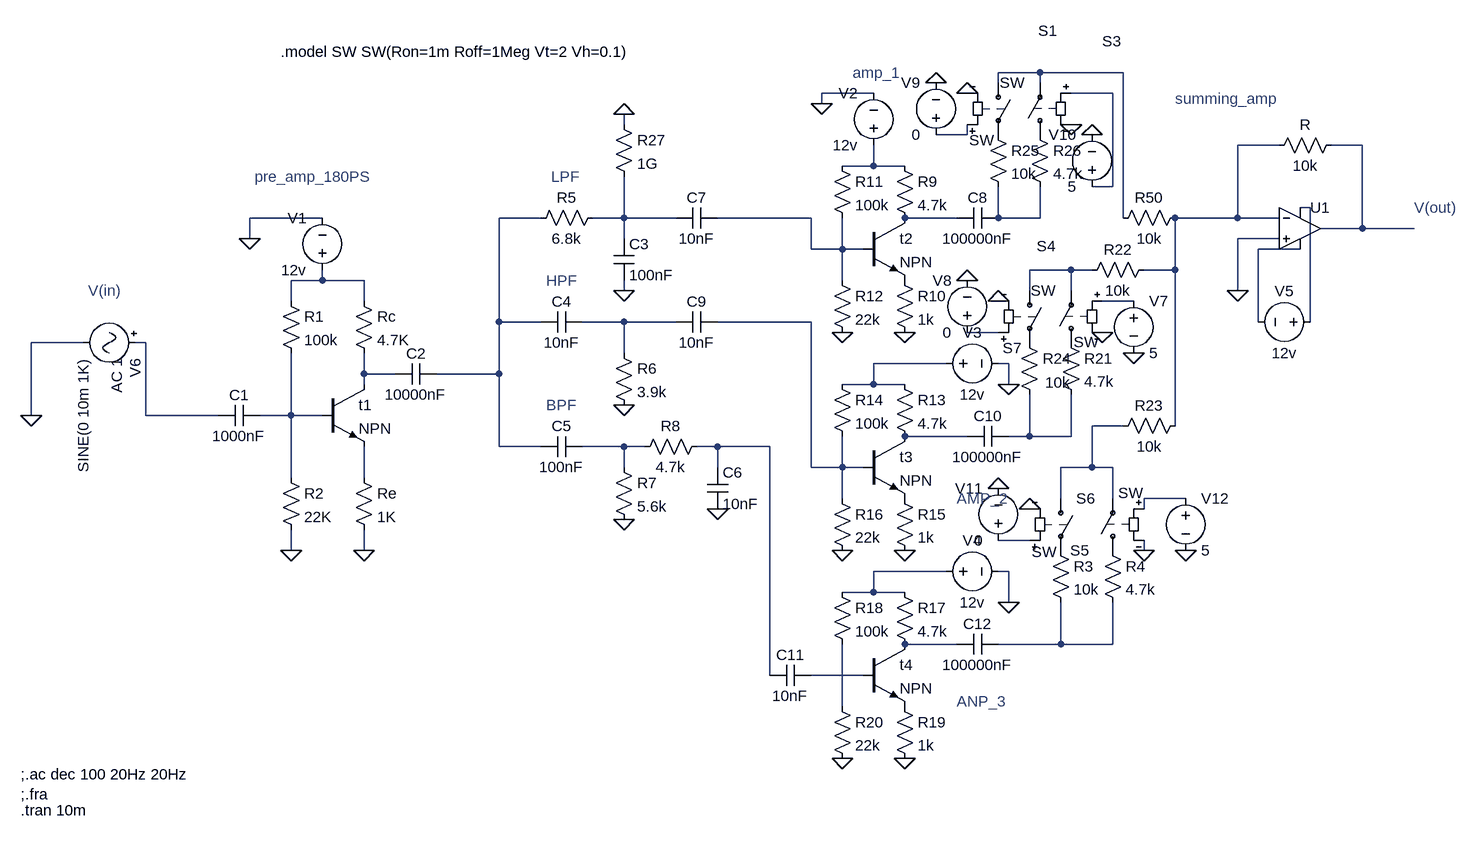
[diagram p0: schematic Audio_AMP.asc]
Audio_AMP.asc, the LTspice schematic file:
Version 4.1
SHEET 1 2056 688
WIRE 1120 -464 1056 -464
WIRE 1248 -464 1120 -464
WIRE 1056 -448 1056 -464
WIRE 1120 -448 1120 -464
WIRE 864 -432 784 -432
WIRE 1232 -432 1168 -432
WIRE 784 -416 784 -432
WIRE 480 -384 480 -400
WIRE 1008 -368 1008 -384
WIRE 1008 -368 960 -368
WIRE 1488 -352 1424 -352
WIRE 1616 -352 1568 -352
WIRE 864 -320 864 -352
WIRE 864 -320 816 -320
WIRE 912 -320 864 -320
WIRE 1232 -288 1232 -432
WIRE 1232 -288 1200 -288
WIRE 1536 -256 1520 -256
WIRE 16 -240 -96 -240
WIRE 352 -240 288 -240
WIRE 480 -240 480 -304
WIRE 480 -240 432 -240
WIRE 560 -240 480 -240
WIRE 768 -240 624 -240
WIRE 992 -240 912 -240
WIRE 1056 -240 1056 -288
WIRE 1120 -240 1120 -288
WIRE 1120 -240 1056 -240
WIRE 1248 -240 1248 -464
WIRE 1424 -240 1424 -352
WIRE 1424 -240 1328 -240
WIRE 1488 -240 1424 -240
WIRE 1616 -224 1616 -352
WIRE 1616 -224 1552 -224
WIRE 1696 -224 1616 -224
WIRE -96 -208 -96 -240
WIRE 480 -208 480 -240
WIRE 1488 -208 1424 -208
WIRE 768 -192 768 -240
WIRE 816 -192 816 -240
WIRE 816 -192 768 -192
WIRE 848 -192 816 -192
WIRE 1520 -192 1456 -192
WIRE 1168 -160 1104 -160
WIRE 1200 -160 1168 -160
WIRE 1328 -160 1328 -240
WIRE 1328 -160 1280 -160
WIRE 16 -144 16 -160
WIRE 16 -144 -32 -144
WIRE 80 -144 16 -144
WIRE 816 -144 816 -192
WIRE 480 -128 480 -144
WIRE 1104 -128 1104 -160
WIRE 1168 -128 1168 -160
WIRE 1424 -128 1424 -208
WIRE -32 -112 -32 -144
WIRE 80 -112 80 -144
WIRE 1264 -112 1216 -112
WIRE 288 -80 288 -240
WIRE 352 -80 288 -80
WIRE 480 -80 416 -80
WIRE 560 -80 480 -80
WIRE 768 -80 624 -80
WIRE 1456 -80 1456 -192
WIRE 1536 -80 1536 -256
WIRE 1056 -64 1008 -64
WIRE -352 -48 -432 -48
WIRE -256 -48 -272 -48
WIRE 480 -32 480 -80
WIRE 976 -16 864 -16
WIRE 1072 -16 1056 -16
WIRE 80 0 80 -32
WIRE 128 0 80 0
WIRE 288 0 288 -80
WIRE 288 0 192 0
WIRE 80 16 80 0
WIRE 864 16 864 -16
WIRE 864 16 816 16
WIRE 912 16 864 16
WIRE 1072 16 1072 -16
WIRE -432 64 -432 -48
WIRE -256 64 -256 -48
WIRE -144 64 -256 64
WIRE -32 64 -32 -32
WIRE -32 64 -80 64
WIRE 16 64 -32 64
WIRE 1248 80 1200 80
WIRE 1328 80 1328 -160
WIRE 1008 96 912 96
WIRE 1104 96 1104 32
WIRE 1104 96 1072 96
WIRE 1168 96 1168 32
WIRE 1168 96 1104 96
WIRE 288 112 288 0
WIRE 352 112 288 112
WIRE 480 112 416 112
WIRE 512 112 480 112
WIRE 624 112 592 112
WIRE 704 112 624 112
WIRE 480 144 480 112
WIRE 624 144 624 112
WIRE 768 144 768 -80
WIRE 816 144 816 96
WIRE 816 144 768 144
WIRE 848 144 816 144
WIRE 1200 144 1200 80
WIRE 1200 144 1152 144
WIRE 1232 144 1200 144
WIRE -32 160 -32 64
WIRE 80 160 80 112
WIRE 816 192 816 144
WIRE 1152 192 1152 144
WIRE 1232 192 1232 144
WIRE 1344 192 1280 192
WIRE 1280 208 1280 192
WIRE 1104 256 1056 256
WIRE -32 272 -32 240
WIRE 80 272 80 240
WIRE 1280 272 1280 256
WIRE 976 304 864 304
WIRE 1072 304 1056 304
WIRE 864 336 864 304
WIRE 864 336 816 336
WIRE 912 336 864 336
WIRE 1072 352 1072 304
WIRE 992 416 912 416
WIRE 1152 416 1152 352
WIRE 1152 416 1056 416
WIRE 1232 416 1232 352
WIRE 1232 416 1152 416
WIRE 704 464 704 112
WIRE 848 464 768 464
WIRE 816 512 816 416
FLAG -32 272 0
FLAG 80 272 0
FLAG -96 -208 0
FLAG 480 -128 0
FLAG 480 48 0
FLAG 480 224 0
FLAG 624 208 0
FLAG 784 -416 0
FLAG 816 -64 0
FLAG 912 -64 0
FLAG 816 272 0
FLAG 912 272 0
FLAG 1072 16 0
FLAG 816 592 0
FLAG 912 592 0
FLAG 1072 352 0
FLAG 1424 -128 0
FLAG -432 64 0
FLAG 480 -400 0
FLAG 960 -448 0
FLAG 1008 -432 0
FLAG 1168 -384 0
FLAG 1200 -368 0
FLAG 1216 -64 0
FLAG 1264 -32 0
FLAG 1104 208 0
FLAG 1056 176 0
FLAG 1280 272 0
FLAG 1344 272 0
FLAG 1008 -144 0
FLAG 1056 -112 0
SYMBOL npn 16 16 R0
SYMATTR InstName t1
SYMBOL res 64 -128 R0
SYMATTR InstName Rc
SYMATTR Value 4.7K
SYMBOL res -48 -128 R0
SYMATTR InstName R1
SYMATTR Value 100k
SYMBOL cap -80 48 R90
WINDOW 0 0 32 VBottom 2
WINDOW 3 32 32 VTop 2
SYMATTR InstName C1
SYMATTR Value 1000nF
SYMBOL cap 192 -16 R90
WINDOW 0 0 32 VBottom 2
WINDOW 3 32 32 VTop 2
SYMATTR InstName C2
SYMATTR Value 10000nF
SYMBOL res -48 144 R0
SYMATTR InstName R2
SYMATTR Value 22K
SYMBOL res 64 144 R0
SYMATTR InstName Re
SYMATTR Value 1K
SYMBOL voltage 16 -144 R180
WINDOW 0 24 96 Left 2
WINDOW 3 24 16 Left 2
WINDOW 123 0 0 Left 0
WINDOW 39 0 0 Left 0
SYMATTR InstName V1
SYMATTR Value 12v
SYMBOL res 336 -224 R270
WINDOW 0 32 56 VTop 2
WINDOW 3 0 56 VBottom 2
SYMATTR InstName R5
SYMATTR Value 6.8k
SYMBOL cap 464 -208 R0
SYMATTR InstName C3
SYMATTR Value 100nF
SYMBOL cap 416 -96 R90
WINDOW 0 0 32 VBottom 2
WINDOW 3 32 32 VTop 2
SYMATTR InstName C4
SYMATTR Value 10nF
SYMBOL res 464 -48 R0
SYMATTR InstName R6
SYMATTR Value 3.9k
SYMBOL cap 416 96 R90
WINDOW 0 0 32 VBottom 2
WINDOW 3 32 32 VTop 2
SYMATTR InstName C5
SYMATTR Value 100nF
SYMBOL res 464 128 R0
SYMATTR InstName R7
SYMATTR Value 5.6k
SYMBOL res 608 96 R90
WINDOW 0 0 56 VBottom 2
WINDOW 3 32 56 VTop 2
SYMATTR InstName R8
SYMATTR Value 4.7k
SYMBOL cap 608 144 R0
SYMATTR InstName C6
SYMATTR Value 10nF
SYMBOL npn 848 -240 R0
SYMATTR InstName t2
SYMBOL res 896 -336 R0
SYMATTR InstName R9
SYMATTR Value 4.7k
SYMBOL res 896 -160 R0
SYMATTR InstName R10
SYMATTR Value 1k
SYMBOL res 800 -336 R0
SYMATTR InstName R11
SYMATTR Value 100k
SYMBOL res 800 -160 R0
SYMATTR InstName R12
SYMATTR Value 22k
SYMBOL voltage 864 -336 R180
WINDOW 0 24 96 Left 2
WINDOW 3 24 16 Left 2
WINDOW 123 0 0 Left 0
WINDOW 39 0 0 Left 0
SYMATTR InstName V2
SYMATTR Value 12v
SYMBOL cap 624 -256 R90
WINDOW 0 0 32 VBottom 2
WINDOW 3 32 32 VTop 2
SYMATTR InstName C7
SYMATTR Value 10nF
SYMBOL cap 1056 -256 R90
WINDOW 0 0 32 VBottom 2
WINDOW 3 32 32 VTop 2
SYMATTR InstName C8
SYMATTR Value 100000nF
SYMBOL npn 848 96 R0
SYMATTR InstName t3
SYMBOL res 896 0 R0
SYMATTR InstName R13
SYMATTR Value 4.7k
SYMBOL res 800 0 R0
SYMATTR InstName R14
SYMATTR Value 100k
SYMBOL res 896 176 R0
SYMATTR InstName R15
SYMATTR Value 1k
SYMBOL res 800 176 R0
SYMATTR InstName R16
SYMATTR Value 22k
SYMBOL voltage 960 -16 R270
WINDOW 0 32 56 VTop 2
WINDOW 3 -32 56 VBottom 2
WINDOW 123 0 0 Left 0
WINDOW 39 0 0 Left 0
SYMATTR InstName V3
SYMATTR Value 12v
SYMBOL cap 624 -96 R90
WINDOW 0 0 32 VBottom 2
WINDOW 3 32 32 VTop 2
SYMATTR InstName C9
SYMATTR Value 10nF
SYMBOL npn 848 416 R0
SYMATTR InstName t4
SYMBOL res 896 320 R0
SYMATTR InstName R17
SYMATTR Value 4.7k
SYMBOL res 800 320 R0
SYMATTR InstName R18
SYMATTR Value 100k
SYMBOL res 896 496 R0
SYMATTR InstName R19
SYMATTR Value 1k
SYMBOL res 800 496 R0
SYMATTR InstName R20
SYMATTR Value 22k
SYMBOL voltage 960 304 R270
WINDOW 0 32 56 VTop 2
WINDOW 3 -32 56 VBottom 2
WINDOW 123 0 0 Left 0
WINDOW 39 0 0 Left 0
SYMATTR InstName V4
SYMATTR Value 12v
SYMBOL cap 768 448 R90
WINDOW 0 0 32 VBottom 2
WINDOW 3 32 32 VTop 2
SYMATTR InstName C11
SYMATTR Value 10nF
SYMBOL cap 1056 400 R90
WINDOW 0 0 32 VBottom 2
WINDOW 3 32 32 VTop 2
SYMATTR InstName C12
SYMATTR Value 100000nF
SYMBOL cap 1072 80 R90
WINDOW 0 0 32 VBottom 2
WINDOW 3 32 32 VTop 2
SYMATTR InstName C10
SYMATTR Value 100000nF
SYMBOL OpAmps\\UniversalOpAmp2 1520 -224 R0
SYMATTR InstName U1
SYMBOL res 1344 -256 R90
WINDOW 0 0 56 VBottom 2
WINDOW 3 32 56 VTop 2
SYMATTR InstName R50
SYMATTR Value 10k
SYMBOL res 1296 -176 R90
WINDOW 0 0 56 VBottom 2
WINDOW 3 32 56 VTop 2
SYMATTR InstName R22
SYMATTR Value 10k
SYMBOL res 1344 64 R90
WINDOW 0 0 56 VBottom 2
WINDOW 3 32 56 VTop 2
SYMATTR InstName R23
SYMATTR Value 10k
SYMBOL res 1584 -368 R90
WINDOW 0 0 56 VBottom 2
WINDOW 3 32 56 VTop 2
SYMATTR InstName R
SYMATTR Value 10k
SYMBOL voltage 1552 -80 R90
WINDOW 0 -32 56 VBottom 2
WINDOW 3 32 56 VTop 2
WINDOW 123 0 0 Left 0
WINDOW 39 0 0 Left 0
SYMATTR InstName V5
SYMATTR Value 12v
SYMBOL res 1136 256 R0
SYMATTR InstName R3
SYMATTR Value 10k
SYMBOL res 1216 256 R0
SYMATTR InstName R4
SYMATTR Value 4.7k
SYMBOL res 1152 -64 R0
SYMATTR InstName R21
SYMATTR Value 4.7k
SYMBOL res 1088 -64 R0
WINDOW 3 40 77 Left 2
SYMATTR Value 10k
SYMATTR InstName R24
SYMBOL res 1040 -384 R0
SYMATTR InstName R25
SYMATTR Value 10k
SYMBOL res 1104 -384 R0
SYMATTR InstName R26
SYMATTR Value 4.7k
SYMBOL Misc\\signal -256 -48 R90
WINDOW 123 24 44 Left 2
WINDOW 39 0 0 Left 0
SYMATTR Value2 AC 1
SYMATTR InstName V6
SYMATTR Value SINE(0 10m 1K)
SYMBOL sw 1056 -464 R0
WINDOW 0 61 -64 Left 2
WINDOW 3 -45 104 Left 2
SYMATTR InstName S1
SYMBOL sw 1120 -352 R180
WINDOW 0 -125 160 Left 2
SYMATTR InstName S3
SYMBOL sw 1104 -144 R0
WINDOW 0 11 -53 Left 2
WINDOW 3 68 95 Left 2
SYMATTR InstName S4
SYMBOL sw 1168 -32 R180
WINDOW 0 76 8 Left 2
SYMATTR InstName S7
SYMBOL sw 1232 288 R180
WINDOW 0 36 16 Left 2
WINDOW 3 -47 105 Left 2
SYMATTR InstName S5
SYMBOL sw 1152 176 R0
WINDOW 3 -45 98 Left 2
SYMATTR InstName S6
SYMBOL voltage 1264 -128 R0
WINDOW 123 0 0 Left 0
WINDOW 39 0 0 Left 0
SYMATTR InstName V7
SYMATTR Value 5
SYMBOL voltage 1008 -48 R180
WINDOW 0 24 96 Left 2
WINDOW 3 24 16 Left 2
WINDOW 123 0 0 Left 0
WINDOW 39 0 0 Left 0
SYMATTR InstName V8
SYMATTR Value 0
SYMBOL voltage 960 -352 R180
WINDOW 0 24 96 Left 2
WINDOW 3 24 16 Left 2
WINDOW 123 0 0 Left 0
WINDOW 39 0 0 Left 0
SYMATTR InstName V9
SYMATTR Value 0
SYMBOL voltage 1200 -272 R180
WINDOW 0 24 96 Left 2
WINDOW 3 24 16 Left 2
WINDOW 123 0 0 Left 0
WINDOW 39 0 0 Left 0
SYMATTR InstName V10
SYMATTR Value 5
SYMBOL voltage 1056 272 R180
WINDOW 0 24 96 Left 2
WINDOW 3 24 16 Left 2
WINDOW 123 0 0 Left 0
WINDOW 39 0 0 Left 0
SYMATTR InstName V11
SYMATTR Value 0
SYMBOL voltage 1344 176 R0
WINDOW 123 0 0 Left 0
WINDOW 39 0 0 Left 0
SYMATTR InstName V12
SYMATTR Value 5
SYMBOL res 464 -400 R0
SYMATTR InstName R27
SYMATTR Value 1G
TEXT -88 -304 Left 2 ;pre_amp_180PS
TEXT 368 -304 Left 2 ;LPF
TEXT 360 -144 Left 2 ;HPF
TEXT 360 48 Left 2 ;BPF
TEXT 832 -464 Left 2 ;amp_1
TEXT 992 192 Left 2 ;AMP_2
TEXT 992 504 Left 2 ;ANP_3
TEXT -344 -128 Left 2 ;V(in)
TEXT 1328 -424 Left 2 ;summing_amp
TEXT 1696 -256 Left 2 ;V(out)
TEXT -448 616 Left 2 !;.ac dec 100 20Hz 20Hz\n;.fra
TEXT -48 -496 Left 2 !.model SW SW(Ron=1m Roff=1Meg Vt=2 Vh=0.1)
TEXT -448 672 Left 2 !.tran 10m

The netlist it stands for:
* Audio_AMP.asc
Q§t1 N022 N023 N029 0 NPN
Rc N015 N022 4.7K
R1 N015 N023 100k
C1 N023 N020 1000nF
C2 N008 N022 10000nF
R2 N023 0 22K
Re N029 0 1K
V1 N015 0 12v
R5 N008 N009 6.8k
C3 N009 0 100nF
C4 N017 N008 10nF
R6 N017 0 3.9k
C5 N027 N008 100nF
R7 N027 0 5.6k
R8 N028 N027 4.7k
C6 N028 0 10nF
Q§t2 N011 N010 P001 0 NPN
R9 N006 N011 4.7k
R10 P001 0 1k
R11 N006 N010 100k
R12 N010 0 22k
V2 N006 0 12v
C7 N010 N009 10nF
C8 N012 N011 100000nF
Q§t3 N025 N018 P002 0 NPN
R13 N021 N025 4.7k
R14 N021 N018 100k
R15 P002 0 1k
R16 N018 0 22k
V3 N021 0 12v
C9 N018 N017 10nF
Q§t4 N033 N035 P003 0 NPN
R17 N032 N033 4.7k
R18 N032 N036 100k
R19 P003 0 1k
R20 N036 0 22k
V4 N032 0 12v
C11 N035 N028 10nF
C12 N034 N033 100000nF
C10 N026 N025 100000nF
X§U1 0 N004 N007 N013 N005 level2 Avol=1Meg GBW=10Meg Slew=10Meg Ilimit=25m Rail=0 Vos=0 En=0 Enk=0 In=0 Ink=0 Rin=500Meg  ; pins In+ In- V+ V- OUT
R50 N004 N001 10k
R22 N004 N014 10k
R23 N004 N024 10k
R N005 N004 10k
V5 N007 N013 12v
R3 P004 N034 10k
R4 P005 N034 4.7k
R21 P006 N026 4.7k
R24 P007 N026 10k
R25 P008 N012 10k
R26 P009 N012 4.7k
V6 N020 0 SINE(0 10m 1K) AC 1
S1 N001 P008 N003 0 SW
S3 P009 N001 N002 0 SW
S4 N014 P007 N019 0 SW
S7 P006 N014 N016 0 SW
S5 P005 N024 N030 0 SW
S6 N024 P004 N031 0 SW
V7 N016 0 5
V8 N019 0 0
V9 N003 0 0
V10 N002 0 5
V11 N031 0 0
V12 N030 0 5
R27 0 N009 1G
.model NPN NPN
.model PNP PNP
.lib standard.bjt
* pre_amp_180PS
* LPF
* HPF
* BPF
* amp_1
* AMP_2
* ANP_3
* V(in)
* summing_amp
* V(out)
;.ac dec 100 20Hz 20Hz
;.fra
.model SW SW(Ron=1m Roff=1Meg Vt=2 Vh=0.1)
.tran 10m
.lib UniversalOpAmp2.lib
.backanno
.end